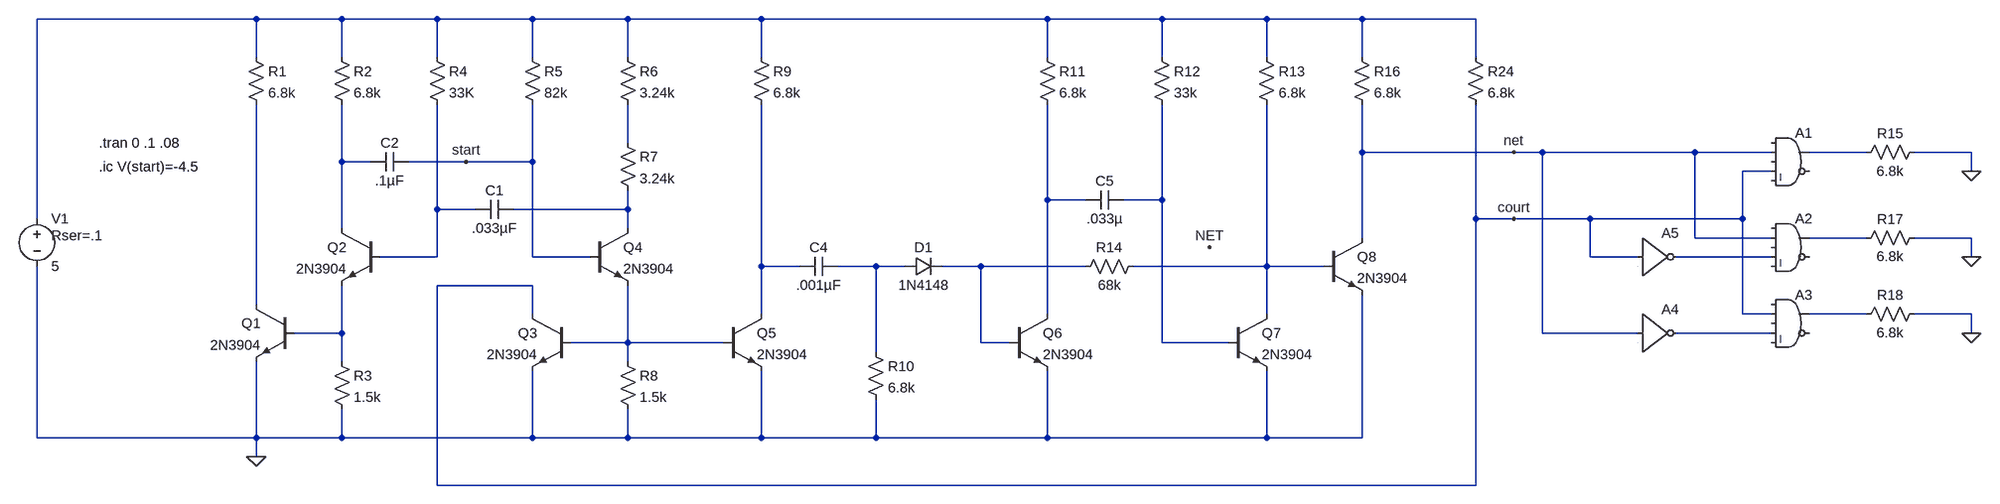
[diagram p0: schematic t42objectClock.asc]
t42objectClock.asc, the LTspice schematic file:
Version 4
SHEET 1 3380 680
WIRE -560 -1280 -928 -1280
WIRE -416 -1280 -560 -1280
WIRE -256 -1280 -416 -1280
WIRE -96 -1280 -256 -1280
WIRE 64 -1280 -96 -1280
WIRE 288 -1280 64 -1280
WIRE 768 -1280 288 -1280
WIRE 960 -1280 768 -1280
WIRE 1136 -1280 960 -1280
WIRE 1296 -1280 1136 -1280
WIRE 1520 -1280 1296 -1280
WIRE -560 -1216 -560 -1280
WIRE -416 -1216 -416 -1280
WIRE -256 -1216 -256 -1280
WIRE -96 -1216 -96 -1280
WIRE 64 -1216 64 -1280
WIRE 288 -1216 288 -1280
WIRE 768 -1216 768 -1280
WIRE 960 -1216 960 -1280
WIRE 1136 -1216 1136 -1280
WIRE 1296 -1216 1296 -1280
WIRE 1520 -1216 1520 -1280
WIRE 64 -1072 64 -1136
WIRE 1296 -1056 1296 -1136
WIRE 1584 -1056 1296 -1056
WIRE 1632 -1056 1584 -1056
WIRE 1888 -1056 1632 -1056
WIRE 2016 -1056 1888 -1056
WIRE 2176 -1056 2080 -1056
WIRE 2352 -1056 2256 -1056
WIRE -416 -1040 -416 -1136
WIRE -368 -1040 -416 -1040
WIRE -208 -1040 -304 -1040
WIRE -96 -1040 -96 -1136
WIRE -96 -1040 -208 -1040
WIRE 2016 -1024 1968 -1024
WIRE 2352 -1024 2352 -1056
WIRE 768 -976 768 -1136
WIRE 832 -976 768 -976
WIRE 960 -976 960 -1136
WIRE 960 -976 896 -976
WIRE -256 -960 -256 -1136
WIRE -192 -960 -256 -960
WIRE 64 -960 64 -992
WIRE 64 -960 -128 -960
WIRE -928 -944 -928 -1280
WIRE 1520 -944 1520 -1136
WIRE 1584 -944 1520 -944
WIRE 1712 -944 1584 -944
WIRE 1968 -944 1968 -1024
WIRE 1968 -944 1712 -944
WIRE -416 -928 -416 -1040
WIRE 64 -928 64 -960
WIRE 1296 -912 1296 -1056
WIRE 1888 -912 1888 -1056
WIRE 2016 -912 1888 -912
WIRE 2176 -912 2080 -912
WIRE 2352 -912 2256 -912
WIRE -256 -880 -256 -960
WIRE -256 -880 -352 -880
WIRE -96 -880 -96 -1040
WIRE 0 -880 -96 -880
WIRE 1712 -880 1712 -944
WIRE 1792 -880 1712 -880
WIRE 2016 -880 1856 -880
WIRE 2352 -880 2352 -912
WIRE 288 -864 288 -1136
WIRE 352 -864 288 -864
WIRE 480 -864 416 -864
WIRE 528 -864 480 -864
WIRE 656 -864 592 -864
WIRE 832 -864 656 -864
WIRE 1136 -864 1136 -1136
WIRE 1136 -864 912 -864
WIRE 1232 -864 1136 -864
WIRE -96 -832 -256 -832
WIRE -560 -800 -560 -1136
WIRE -96 -784 -96 -832
WIRE 288 -784 288 -864
WIRE 768 -784 768 -976
WIRE 1136 -784 1136 -864
WIRE 1968 -784 1968 -944
WIRE 2016 -784 1968 -784
WIRE 2176 -784 2080 -784
WIRE 2352 -784 2256 -784
WIRE -416 -752 -416 -832
WIRE -416 -752 -496 -752
WIRE 1632 -752 1632 -1056
WIRE 1792 -752 1632 -752
WIRE 2016 -752 1856 -752
WIRE 2352 -752 2352 -784
WIRE 64 -736 64 -832
WIRE 64 -736 -32 -736
WIRE 224 -736 64 -736
WIRE 656 -736 656 -864
WIRE 704 -736 656 -736
WIRE 960 -736 960 -976
WIRE 1072 -736 960 -736
WIRE 480 -720 480 -864
WIRE -416 -704 -416 -752
WIRE 64 -704 64 -736
WIRE -928 -576 -928 -864
WIRE -560 -576 -560 -704
WIRE -560 -576 -928 -576
WIRE -416 -576 -416 -624
WIRE -416 -576 -560 -576
WIRE -96 -576 -96 -688
WIRE -96 -576 -416 -576
WIRE 64 -576 64 -624
WIRE 64 -576 -96 -576
WIRE 288 -576 288 -688
WIRE 288 -576 64 -576
WIRE 480 -576 480 -640
WIRE 480 -576 288 -576
WIRE 768 -576 768 -688
WIRE 768 -576 480 -576
WIRE 1136 -576 1136 -688
WIRE 1136 -576 768 -576
WIRE 1296 -576 1296 -816
WIRE 1296 -576 1136 -576
WIRE -560 -544 -560 -576
WIRE -256 -496 -256 -832
WIRE 1520 -496 1520 -944
WIRE 1520 -496 -256 -496
FLAG -560 -544 0
FLAG -208 -1040 start
FLAG 1040 -896 NET
FLAG 1584 -944 court
FLAG 1584 -1056 net
FLAG 2352 -1024 0
FLAG 2352 -880 0
FLAG 2352 -752 0
SYMBOL npn -496 -800 M0
SYMATTR InstName Q1
SYMATTR Value 2N3904
SYMBOL npn -352 -928 M0
SYMATTR InstName Q2
SYMATTR Value 2N3904
SYMBOL npn -32 -784 M0
SYMATTR InstName Q3
SYMATTR Value 2N3904
SYMBOL npn 0 -928 R0
SYMATTR InstName Q4
SYMATTR Value 2N3904
SYMBOL npn 224 -784 R0
SYMATTR InstName Q5
SYMATTR Value 2N3904
SYMBOL npn 704 -784 R0
SYMATTR InstName Q6
SYMATTR Value 2N3904
SYMBOL npn 1072 -784 R0
SYMATTR InstName Q7
SYMATTR Value 2N3904
SYMBOL res -576 -1232 R0
SYMATTR InstName R1
SYMATTR Value 6.8k
SYMBOL res -432 -1232 R0
SYMATTR InstName R2
SYMATTR Value 6.8k
SYMBOL res -432 -720 R0
SYMATTR InstName R3
SYMATTR Value 1.5k
SYMBOL res -272 -1232 R0
SYMATTR InstName R4
SYMATTR Value 33K
SYMBOL res -112 -1232 R0
SYMATTR InstName R5
SYMATTR Value 82k
SYMBOL cap -128 -976 R90
WINDOW 0 0 32 VBottom 2
WINDOW 3 32 32 VTop 2
SYMATTR InstName C1
SYMATTR Value .033µF
SYMBOL res 48 -1232 R0
SYMATTR InstName R6
SYMATTR Value 3.24k
SYMBOL res 48 -1088 R0
SYMATTR InstName R7
SYMATTR Value 3.24k
SYMBOL res 48 -720 R0
SYMATTR InstName R8
SYMATTR Value 1.5k
SYMBOL res 272 -1232 R0
SYMATTR InstName R9
SYMATTR Value 6.8k
SYMBOL cap 416 -880 R90
WINDOW 0 0 32 VBottom 2
WINDOW 3 32 32 VTop 2
SYMATTR InstName C4
SYMATTR Value .001µF
SYMBOL diode 528 -880 M90
WINDOW 0 0 32 VBottom 2
WINDOW 3 32 32 VTop 2
SYMATTR InstName D1
SYMATTR Value 1N4148
SYMBOL res 464 -736 R0
SYMATTR InstName R10
SYMATTR Value 6.8k
SYMBOL res 752 -1232 R0
SYMATTR InstName R11
SYMATTR Value 6.8k
SYMBOL cap 896 -992 R90
WINDOW 0 0 32 VBottom 2
WINDOW 3 32 32 VTop 2
SYMATTR InstName C5
SYMATTR Value .033µ
SYMBOL res 944 -1232 R0
SYMATTR InstName R12
SYMATTR Value 33k
SYMBOL res 1120 -1232 R0
SYMATTR InstName R13
SYMATTR Value 6.8k
SYMBOL res 928 -880 R90
WINDOW 0 0 56 VBottom 2
WINDOW 3 32 56 VTop 2
SYMATTR InstName R14
SYMATTR Value 68k
SYMBOL res 1504 -1232 R0
SYMATTR InstName R24
SYMATTR Value 6.8k
SYMBOL voltage -928 -960 R0
WINDOW 123 0 0 Left 2
WINDOW 39 24 44 Left 2
SYMATTR SpiceLine Rser=.1
SYMATTR InstName V1
SYMATTR Value 5
SYMBOL cap -304 -1056 R90
WINDOW 0 0 32 VBottom 2
WINDOW 3 32 32 VTop 2
SYMATTR InstName C2
SYMATTR Value .1µF
SYMBOL npn 1232 -912 R0
SYMATTR InstName Q8
SYMATTR Value 2N3904
SYMBOL res 1280 -1232 R0
SYMATTR InstName R16
SYMATTR Value 6.8k
SYMBOL Digital\\and 2048 -1104 R0
SYMATTR InstName A1
SYMBOL Digital\\and 2048 -960 R0
SYMATTR InstName A2
SYMBOL Digital\\and 2048 -832 R0
SYMATTR InstName A3
SYMBOL Digital\\inv 1792 -816 R0
SYMATTR InstName A4
SYMBOL Digital\\inv 1792 -944 R0
SYMATTR InstName A5
SYMBOL res 2272 -1072 R90
WINDOW 0 0 56 VBottom 2
WINDOW 3 32 56 VTop 2
SYMATTR InstName R15
SYMATTR Value 6.8k
SYMBOL res 2272 -928 R90
WINDOW 0 0 56 VBottom 2
WINDOW 3 32 56 VTop 2
SYMATTR InstName R17
SYMATTR Value 6.8k
SYMBOL res 2272 -800 R90
WINDOW 0 0 56 VBottom 2
WINDOW 3 32 56 VTop 2
SYMATTR InstName R18
SYMATTR Value 6.8k
TEXT -824 -1072 Left 2 !.tran 0 .1 .08
TEXT -824 -1032 Left 2 !.ic V(start)=-4.5

The netlist it stands for:
* t42objectClock.asc
Q1 N015 N017 0 0 2N3904
Q2 N004 N007 N017 0 2N3904
Q3 court N019 0 0 2N3904
Q4 N008 start N019 0 2N3904
Q5 N011 N019 0 0 2N3904
Q6 N005 N013 0 0 2N3904
Q7 N014 N006 0 0 2N3904
R1 N001 N015 6.8k
R2 N001 N004 6.8k
R3 N017 0 1.5k
R4 N001 N007 33K
R5 N001 start 82k
C1 N008 N007 .033µF
R6 N001 N002 3.24k
R7 N002 N008 3.24k
R8 N019 0 1.5k
R9 N001 N011 6.8k
C4 N012 N011 .001µF
D1 N012 N013 1N4148
R10 N012 0 6.8k
R11 N001 N005 6.8k
C5 N006 N005 .033µ
R12 N001 N006 33k
R13 N001 N014 6.8k
R14 N014 N013 68k
R24 N001 court 6.8k
V1 N001 0 5 Rser=.1
C2 start N004 .1µF
Q8 NET N014 0 0 2N3904
R16 N001 NET 6.8k
A1 0 NET 0 court 0 0 N003 0 AND
A2 0 NET 0 N010 0 0 N009 0 AND
A3 0 court 0 N018 0 0 N016 0 AND
A4 NET 0 0 0 0 N018 0 0 BUF
A5 court 0 0 0 0 N010 0 0 BUF
R15 0 N003 6.8k
R17 0 N009 6.8k
R18 0 N016 6.8k
.model D D
.lib standard.dio
.model NPN NPN
.model PNP PNP
.lib standard.bjt
.tran 0 .1 .08
.ic V(start)=-4.5
.backanno
.end